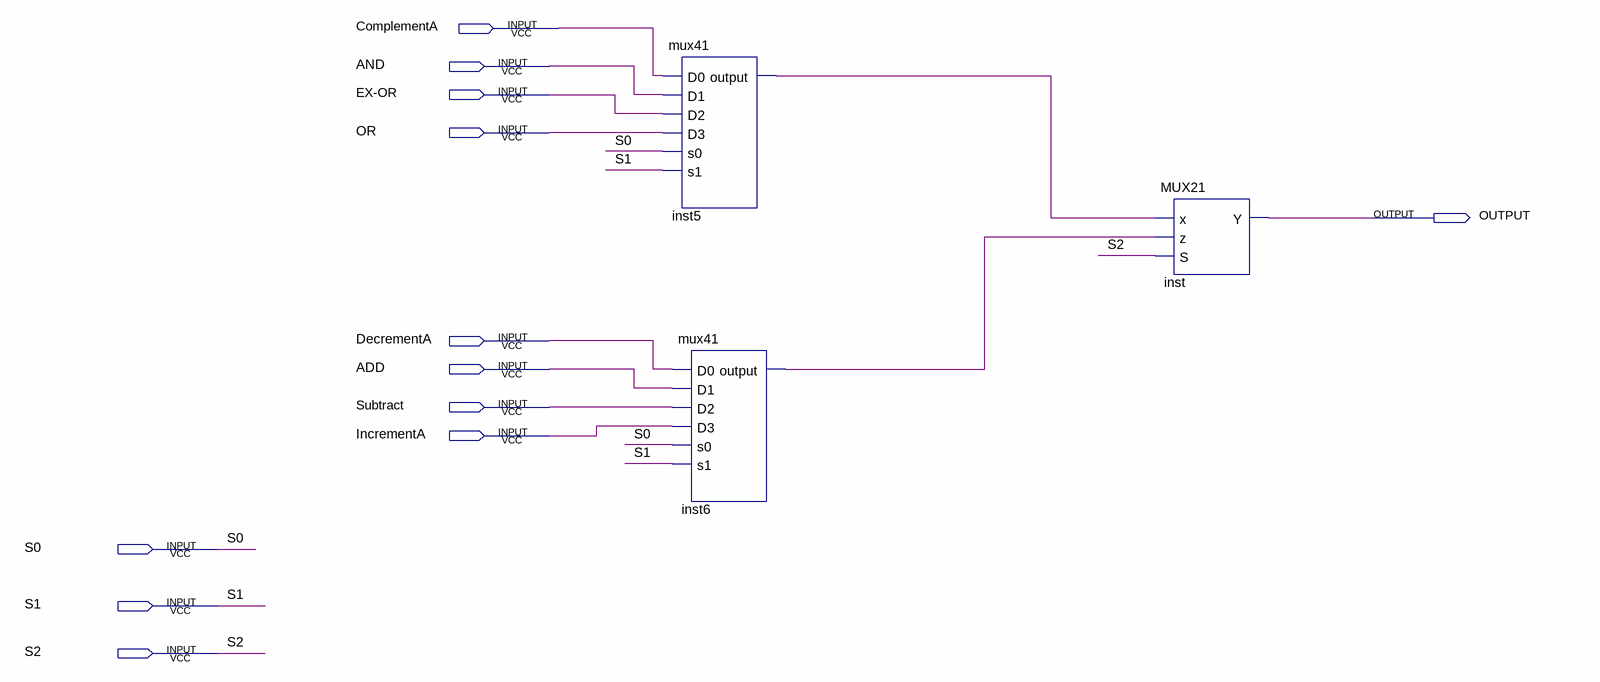
[diagram p0: schematic sheet]
// Quartus schematic MUX81.bdf as structural Verilog: 3 symbols, 12 pins
module MUX81 (
  input  ComplementA,
  input  AND,
  input  \EX-OR ,
  input  OR,
  input  DecrementA,
  input  ADD,
  input  Subtract,
  input  IncrementA,
  input  S0,
  input  S1,
  input  S2,
  output OUTPUT
);

  wire inst5_output, inst6_output;

  mux41 inst5 (.D0(ComplementA), .D1(AND), .D2(\EX-OR ), .D3(OR), .s0(S0), .s1(S1), .\output (inst5_output));
  mux41 inst6 (.D0(DecrementA), .D1(ADD), .D2(Subtract), .D3(IncrementA), .s0(S0), .s1(S1), .\output (inst6_output));
  MUX21 inst (.x(inst5_output), .z(inst6_output), .S(S2), .Y(OUTPUT));
endmodule
